# EAGLE design daclock-2.0 (EAGLE 8.0.1)
PROJECT_AUTHOR: tinkerman.cat <xose.perez@gmail.com>; PROJECT_LICENSE: CC-BY-SA-NC 3.0; PROJECT_NAME: DACLOCK WIFI; PROJECT_VERSION: 2.0.20160612
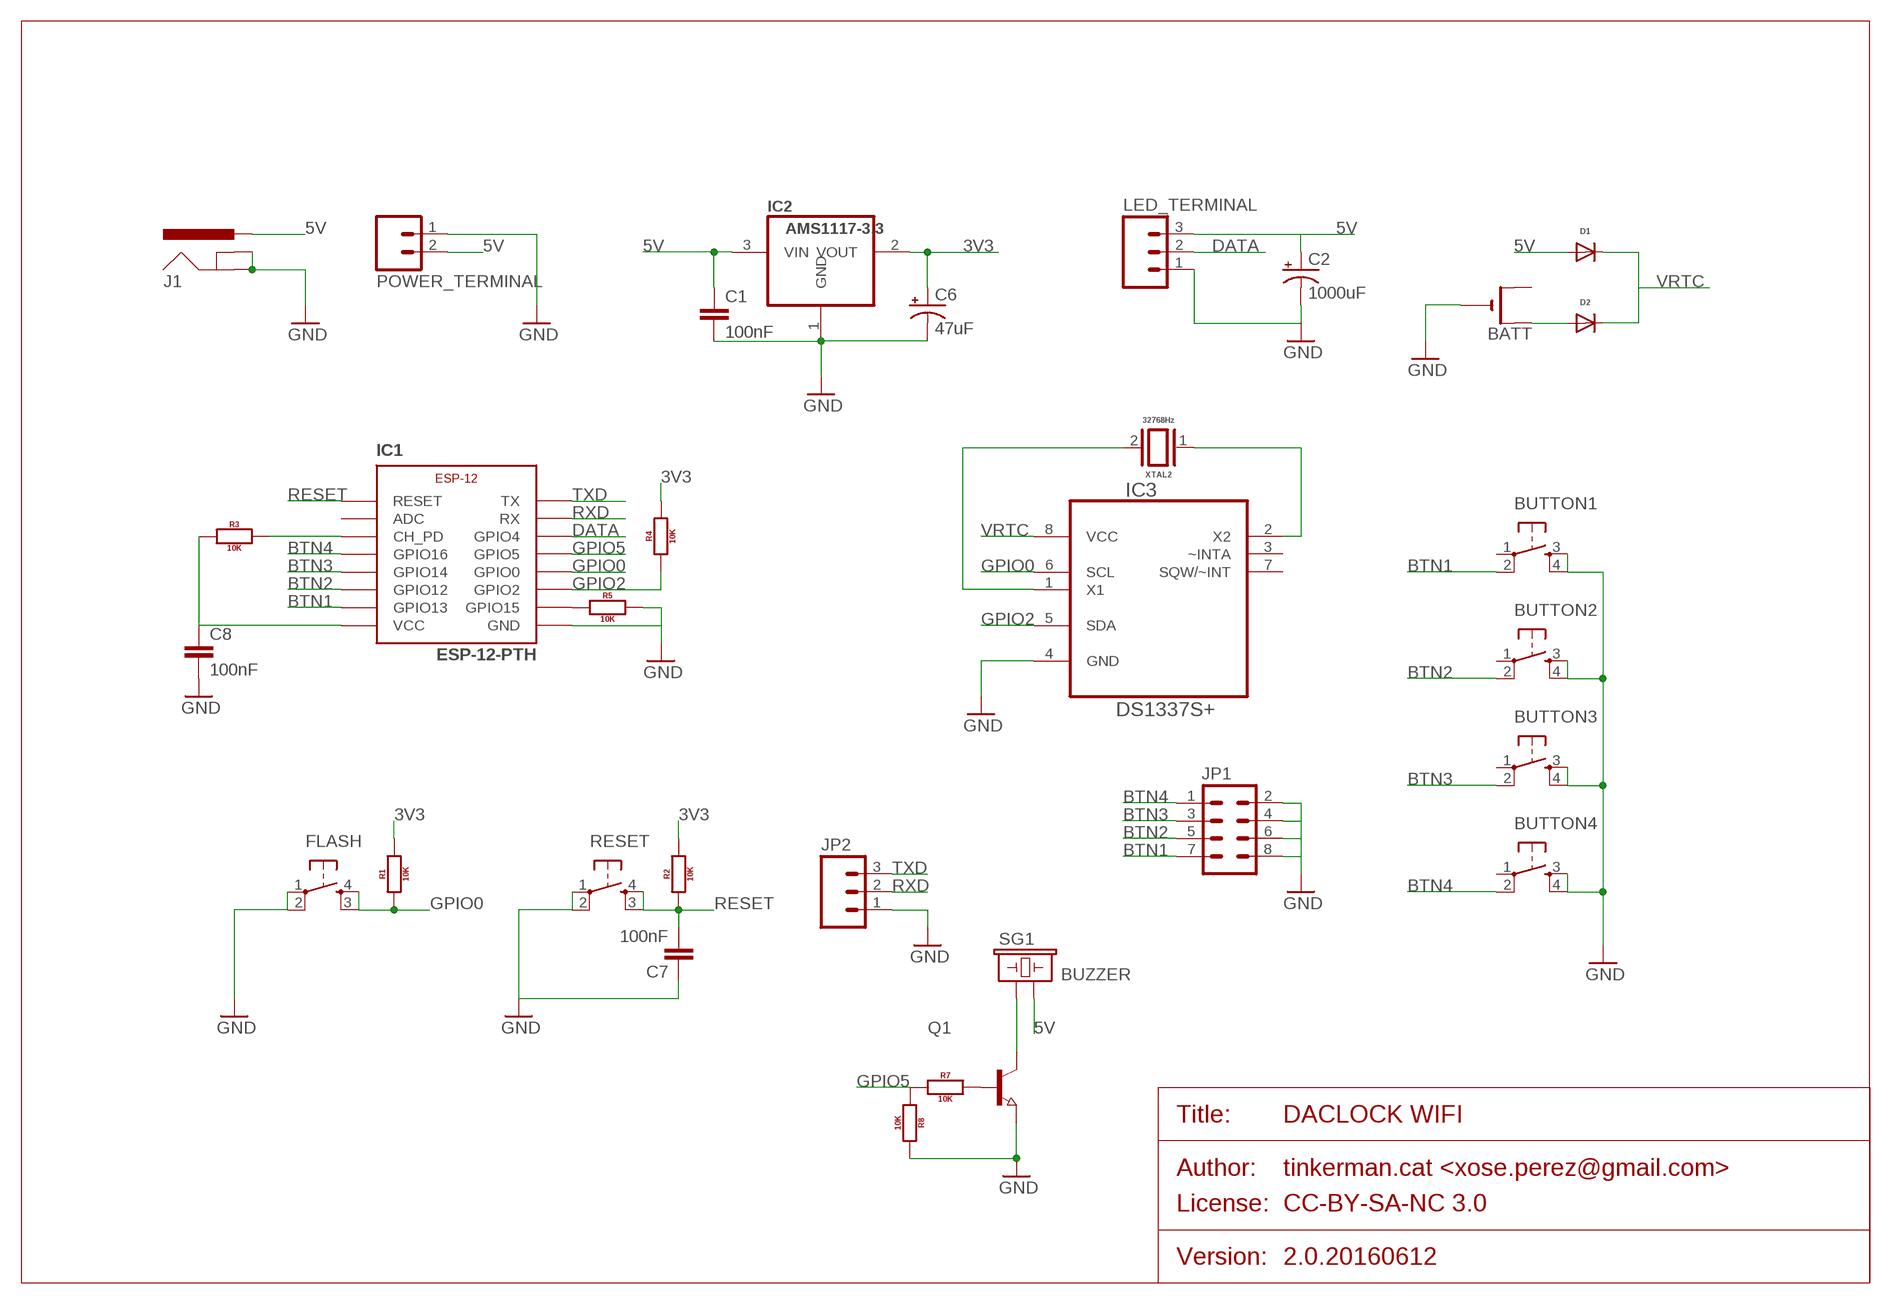
[diagram p0: schematic, sheet 1]

## Parts
BATT  CR2032SMT  [CR2032-SMD]
BUTTON1  BTN1  TACTILE_BUTTON_PTH  [TACTILE-BUTTON]
BUTTON2  BTN2  TACTILE_BUTTON_PTH  [TACTILE-BUTTON]
BUTTON3  BTN3  TACTILE_BUTTON_PTH  [TACTILE-BUTTON]
BUTTON4  BTN4  TACTILE_BUTTON_PTH  [TACTILE-BUTTON]
C1  100nF  C-EU0805  [0805]
C2  1000uF  CAP_POLG  [PANASONIC_G]
C6  47uF  CAP_POLC  [PANASONIC_C]
C7  100nF  C-EU0805  [0805]
C8  100nF  C-EU0805  [0805]
D1  DIODE-SMD  [0805_DIODE]
D2  DIODE-SMD  [0805_DIODE]
FLASH  TACTILE_BUTTON_SMD  [TACTILE-BUTTON-SMD]
IC1  ESP-12-PTH  [ESP-12-PTH]
IC2  AMS1117-3.3  REG1117  [SOT223]
IC3  DS1337S+  [SOIC127P600X175-8N]
J1  POWER_JACKPTH  [POWER_JACK_PTH]
JP1  M04X2  [2X4]
JP2  M03PTH  [1X03]
LED_TERMINAL  M03200MIL  [SCREWTERMINAL-200MIL-3]
POWER_TERMINAL  M02200MIL  [SCREWTERMINAL-200MIL-2]
Q1  NPN-TRANSISTOR_SOT23  [SOT23]
R1  10K  RESISTOR0805  [0805]
R2  10K  RESISTOR0805  [0805]
R3  10K  RESISTOR0805  [0805]
R4  10K  RESISTOR0805  [0805]
R5  10K  RESISTOR0805  [0805]
R7  10K  RESISTOR0805  [0805]
R8  10K  RESISTOR0805  [0805]
RESET  TACTILE_BUTTON_SMD  [TACTILE-BUTTON-SMD]
SG1  BUZZER  BUZZERPTH  [BUZZER-12MM]
XTAL2  32768Hz  CRYSTAL_TC38H  [TC38H]

## Nets
3V3: C6.+ C8.1 IC1.VCC IC2.2(VOUT) R1.2 R2.2 R3.1 R4.2
5V: C1.1 C2.+ D1.A IC2.3(VIN) J1.PWR LED_TERMINAL.3 POWER_TERMINAL.2 SG1.-
BTN1: BUTTON1.2(SWB1) IC1.GPIO13 JP1.7
BTN2: BUTTON2.2(SWB1) IC1.GPIO12 JP1.5
BTN3: BUTTON3.2(SWB1) IC1.GPIO14 JP1.3
BTN4: BUTTON4.2(SWB1) IC1.GPIO16 JP1.1
DATA: IC1.GPIO4 LED_TERMINAL.2
GND: BATT.- BUTTON1.3(SWA2) BUTTON1.4(SWB2) BUTTON2.3(SWA2) BUTTON2.4(SWB2) BUTTON3.3(SWA2) BUTTON3.4(SWB2) BUTTON4.3(SWA2) BUTTON4.4(SWB2) C1.2 C2.- C6.- C7.1 C8.2 FLASH.1(SWA1) FLASH.2(SWB1) IC1.GND IC2.1(GND) IC3.4(GND) J1.GND J1.GNDBREAK JP1.2 JP1.4 JP1.6 JP1.8 JP2.1 LED_TERMINAL.1 POWER_TERMINAL.1 Q1.2(E) R5.2 R8.2 RESET.1(SWA1) RESET.2(SWB1)
GPIO0: FLASH.3(SWB2) FLASH.4(SWA2) IC1.GPIO0 IC3.6(SCL) R1.1
GPIO2: IC1.GPIO2 IC3.5(SDA) R4.1
GPIO5: IC1.GPIO5 R7.1 R8.1
N$1: Q1.1(B) R7.2
N$2: IC3.1(X1) XTAL2.2
N$3: IC3.2(X2) XTAL2.1
N$4: BATT.+$1(+) D2.A
N$6: IC1.CH_PD R3.2
N$8: IC1.GPIO15 R5.1
N$10: Q1.3(C) SG1.+
RESET: C7.2 IC1.RESET R2.1 RESET.3(SWB2) RESET.4(SWA2)
RXD: IC1.RX JP2.2
TXD: IC1.TX JP2.3
VRTC: D1.C D2.C IC3.8(VCC)
Unconnected: BATT.+$2(+1) BUTTON1.1(SWA1) BUTTON2.1(SWA1) BUTTON3.1(SWA1) BUTTON4.1(SWA1) IC1.ADC IC3.3(~INTA) IC3.7(SQW/~INT)

## Library data of the parts
BATT = xose:CR2032
BUTTON1-BUTTON4 FLASH RESET = xose:TACTILE_BUTTON: Tactile Button SparkFun Electronics' Tactile Button COM-10302
C1 C7 C8 = xose:C-EU: CAPACITOR, European symbol
C2 C6 = xose:CAP_POL: Capacitor Polarized These are standard SMD and PTH capacitors. Normally 10uF, 47uF, and 100uF in electrolytic and tantalum varieties. Always verify the external diameter of the through hole cap, it varies with capacity, voltage, and manufacturer. The EIA devices should be standard.
D1 D2 = xose:DIODE
IC1 = xose:ESP-12
IC2 = xose:REG1117: 800mA and 1A Low Dropout (LDO) Positive Regulator 1.8V, 2.5V, 2.85V, 3.3V, 5V, and Adj; MPN: REG1117; OC_FARNELL: 1097566; OC_NEWARK: 14P6981
IC3 = xose:DS1337S+: 64 x 8, Serial, I2C Real-Time Clock; MPN: DS1337S+; OC_FARNELL: 1379748; OC_NEWARK: 08J6237; PACKAGE: SOIC-8; SUPPLIER: Maxim
J1 = xose:POWER_JACK: Power Jack This is the standard 5.5mm barrel jack for power. The PTH is the most common, proven, reliable, footprint. The Slot footprint only works if the mill layer is transmitted to the PCB fab house so be warned. Mating wall wart : TOL-00298 (and others); PROD_ID: CONN-08197
JP1 = xose:M04X2: .1" header, two rows of four.
JP2 LED_TERMINAL = xose:M03: Header 3 Standard 3-pin 0.1" header. Use with straight break away headers (SKU : PRT-00116), right angle break away headers (PRT-00553), swiss pins (PRT-00743), machine pins (PRT-00117), and female headers (PRT-00115). Molex polarized connector foot print use with SKU : PRT-08232 with associated crimp pins and housings.
POWER_TERMINAL = xose:M02: Standard 2-pin 0.1" header. Use with - straight break away headers ( PRT-00116) - right angle break away headers (PRT-00553) - swiss pins (PRT-00743) - machine pins (PRT-00117) - female headers (PRT-00115) Molex polarized connector foot print use with: PRT-08233 with associated crimp pins and housings. 2.54_SCREWTERM for use with PRT-10571. 3.5mm Screw Terminal footprints for PRT-08084 5mm Screw Terminal footprints for use with PRT-08432
Q1 = xose:NPN-TRANSISTOR_: NPN TRANSISTOR
R1-R5 R7 R8 = xose:RESISTOR: Generic EU resistor symbol
SG1 = SparkFun-Electromechanical:BUZZER: Buzzer 12mm Spark Fun Electronics SKU : Comp-Buzzer
XTAL2 = xose:CRYSTAL_TC38H

## Board
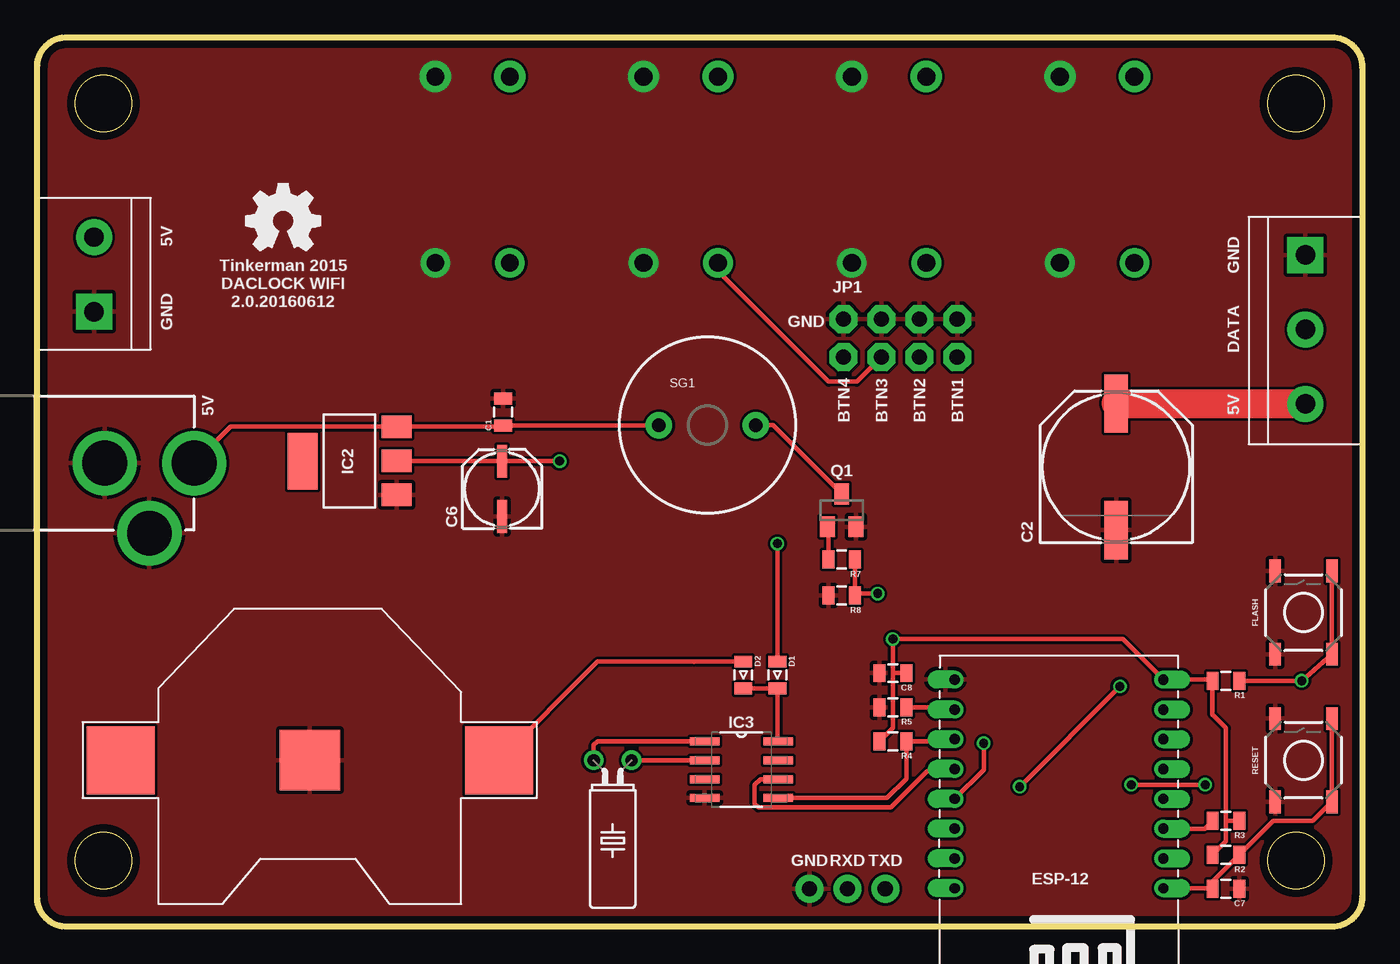
[diagram p1: board, top side]
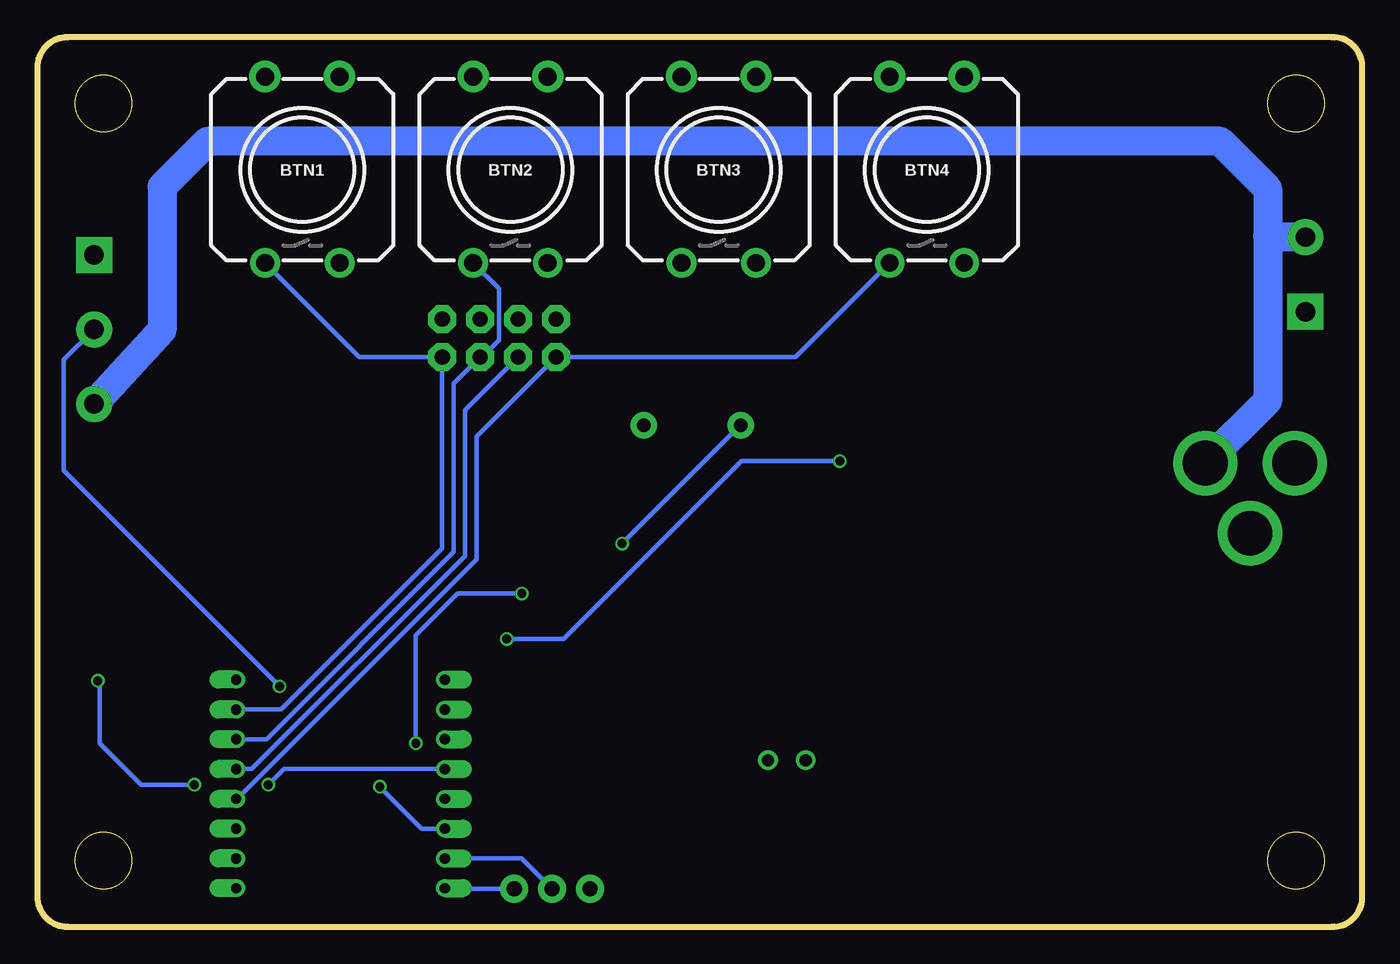
[diagram p2: board, bottom side, seen from below]

Size 88.9 x 59.69 mm. Coordinates in mm from the lower left corner, seen from the top.
Outline: 86.87,0 2.03,0 arc-90 0,1.91 0,57.78 arc-90 2.03,59.69 86.87,59.69 arc-90 88.9,57.66 88.9,2.03 arc-90 86.87,0
Outline: circle at 4.45,55.24 radius 1.91
Outline: circle at 4.45,4.45 radius 1.91
Outline: circle at 84.45,55.24 radius 1.91
Outline: circle at 84.45,4.45 radius 1.91
Copper layers (1*16): Top 0.035mm / dielectric 1.5mm / Bottom 0.035mm
Design rules "smart-prototyping": minimum track width 7mil, minimum drill 12mil, track to track 7mil, track to pad 7mil, pad to pad 7mil, via to via 7mil, smd to smd 0mil, copper to edge 20mil, drill to drill 10mil, minimum pad ring 10mil, minimum via ring 6mil, stop-mask expansion 2mil, vias tented up to drill 25mil, thermal gap 10mil

### Footprints (pad centres in the part's own frame; a part is rotated, then mirrored left to right if it is on the bottom)
CR2032-SMD = smd 4.572 x 4.572: +$1 -12.7,0; +$2 12.7,0 | smd 4.064 x 4.064: - 0,0
TACTILE-BUTTON = drill 1.2 pad 2.1: 1 -2.5,6.25; 3 2.5,6.25 | drill 1.2 pad 2: 2 -2.5,-6.25; 4 2.5,-6.25
0805 = smd 0.8 x 1.2: 1 -0.9,0; 2 0.9,0
PANASONIC_G = smd 3.9 x 1.6: + 4.25,0; - -4.25,0
PANASONIC_C = smd 2.2 x 0.65: + 1.9,-0.2; - -1.8,-0.2
0805_DIODE = smd 0.8 x 1.2: A -0.9,0; C 0.9,0
TACTILE-BUTTON-SMD = smd 1.524 x 0.762: 1 -2.794,1.905; 2 2.794,1.905; 3 -2.794,-1.905; 4 2.794,-1.905
ESP-12-PTH = drill 0.7 offset: ADC -6.465,5.07; CH_PD -6.465,3.07; GND 7.535,-6.93; GPIO0 7.535,-0.93; GPIO2 7.535,-2.93; GPIO4 7.535,3.07; GPIO5 7.535,1.07; GPIO12 -6.465,-2.93; GPIO13 -6.465,-4.93; GPIO14 -6.465,-0.93; GPIO15 7.535,-4.93; GPIO16 -6.465,1.07; RESET -6.465,7.07; RX 7.535,5.07; TX 7.535,7.07; VCC -6.465,-6.93
SOT223 = smd 1.499 x 2.007: 1 -2.261,-3.15; 2 0.025,-3.15; 3 2.311,-3.15 | smd 3.81 x 2.007: 4 0,3.15
SOIC127P600X175-8N = smd 1.981 x 0.533: 1 -2.464,1.905; 2 -2.464,0.635; 3 -2.464,-0.635; 4 -2.464,-1.905; 5 2.464,-1.905; 6 2.464,-0.635; 7 2.464,0.635; 8 2.464,1.905
POWER_JACK_PTH = drill 2.997 pad 4.318: GND 0,7.7; GNDBREAK 4.7,10.7; PWR 0,13.7
2X4 = drill 1.016 pad 1.88 octagon: 1 -3.81,-1.27; 2 -3.81,1.27; 3 -1.27,-1.27; 4 -1.27,1.27; 5 1.27,-1.27; 6 1.27,1.27; 7 3.81,-1.27; 8 3.81,1.27
1X03 = drill 1.016 pad 1.88: 1 0,0; 2 2.54,0; 3 5.08,0
SCREWTERMINAL-200MIL-3 = drill 1.3 pad 2.413 square: 1 0,0 | drill 1.3 pad 2.413: 2 5,0; 3 10,0
SCREWTERMINAL-200MIL-2 = drill 1.3 pad 2.413 square: 1 0,0 | drill 1.3 pad 2.413: 2 5,0
SOT23 = smd 1 x 1.4: 1 -0.95,-1.1; 2 0.95,-1.1; 3 0,1.1
BUZZER-12MM = drill 0.9 pad 1.778: + 3.25,0; - -3.25,0
TC38H = drill 0.813: 1 -1.27,0; 2 1.27,0

### Placement (x,y rotation side)
BATT  18.29,11.18 180 top
BUTTON1  71.12,50.8 0 bottom
BUTTON2  57.15,50.8 0 bottom
BUTTON3  43.18,50.8 0 bottom
BUTTON4  29.21,50.8 0 bottom
C1  31.24,34.54 90 top
C2  72.39,30.86 90 top
C6  30.99,29.34 90 top
C7  79.76,2.54 180 top
C8  57.4,17.02 180 top
D1  49.66,16.89 270 top
D2  47.37,16.89 270 top
FLASH  84.96,21.08 90 top
IC1  69.09,9.65 180 top
IC2  20.95,31.24 90 top
IC3  47.24,10.54 0 top
J1  -3.17,31.11 270 top
JP1  57.91,39.5 0 top
JP2  51.82,2.54 0 top
LED_TERMINAL  85.09,45.09 270 top
POWER_TERMINAL  3.81,41.27 90 top
Q1  53.98,27.94 0 top
R1  79.76,16.51 180 top
R2  79.76,4.83 180 top
R3  79.76,7.11 180 top
R4  57.4,12.45 180 top
R5  57.4,14.73 180 top
R7  53.98,24.64 180 top
R8  53.98,22.23 180 top
RESET  84.96,11.18 90 top
SG1  44.96,33.66 0 top
XTAL2  38.61,11.18 180 top

### Tracks (layer width: path | path; a pad name or v marks a point on that pad's centre or on a via)
3V3  (via drill 0.6)
  Top 0.305: IC2.2 31.16,31.27 C6.+ v35.05,31.24 | 79.76,7.11 79.76,5.73 R2.2 | 79.76,7.11 79.76,13.34 78.87,14.22 78.86,14.22 R1.2 78.78,16.58 IC1.VCC 72.83,19.3 v57.4,19.3 57.4,17.02 | R3.1 79.76,7.11 | R4.2 57.4,13.35 57.4,17.02 | C8.1 57.4,17.02
  Bottom 0.305: v57.4,19.3 53.59,19.3 41.66,31.24 v35.05,31.24
5V  (via drill 0.6)
  Top 0.305: J1.PWR 12.96,33.55 IC2.3 31.15,33.55 C1.1 41.7,33.64 SG1.- | D1.A v49.66,25.71
  Top 1.93: C2.+ 85.06,35.11 LED_TERMINAL.3
  Bottom 0.305: v49.66,25.71 SG1.-
  Bottom 1.93: LED_TERMINAL.3 80.52,40.04 80.52,49.66 77.47,52.7 9.53,52.7 6.35,49.53 6.35,46.35 | 6.35,46.35 6.35,35.29 J1.PWR | POWER_TERMINAL.2 6.27,46.27 6.35,46.35
BTN1
  Bottom 0.305: IC1.GPIO13 72.54,14.58 61.72,25.4 JP1.7 67.3,38.23 BUTTON1.2
BTN2
  Bottom 0.305: IC1.GPIO12 73.52,12.58 60.96,25.15 60.96,36.45 JP1.5 59.05,38.23 57.91,39.37 57.91,42.81 BUTTON2.2
BTN3
  Top 0.305: JP1.3 54.99,36.58 53.09,36.58 45.68,43.98 BUTTON3.2
  Bottom 0.305: IC1.GPIO14 74.51,10.58 60.2,24.89 60.2,34.67 JP1.3
BTN4
  Bottom 0.305: IC1.GPIO16 75.49,8.58 59.44,24.64 59.44,32.89 JP1.1 38.03,38.23 BUTTON4.2
DATA  (via drill 0.6)
  Top 0.305: v65.91,9.4 v72.64,16.13
  Bottom 0.305: IC1.GPIO4 63.1,6.58 v65.91,9.4 | v72.64,16.13 87.12,30.61 87.12,38.05 LED_TERMINAL.2
GND
  pour Top: 0,59.69 88.9,59.69 88.9,0 0,0
GPIO0  (via drill 0.6)
  Top 0.305: FLASH.4 FLASH.3 v84.84,16.51 R1.1 80.66,16.52 | v78.36,9.53 v73.41,9.53 | IC1.GPIO0 61.38,10.41 59.69,10.41 57.28,8 48.39,8 48.13,8.26 48.13,9.53 48.51,9.91 IC3.6
  Bottom 0.305: v78.36,9.53 81.92,9.53 84.71,12.32 84.71,16.38 v84.84,16.51 | v73.41,9.53 72.35,10.58 IC1.GPIO0
GPIO2
  Top 0.305: IC3.5 57.02,8.64 58.3,9.92 R4.1 61.55,12.45 IC1.GPIO2
GPIO5  (via drill 0.6)
  Top 0.305: IC1.GPIO5 63.5,10.53 v63.5,12.32 | v56.39,22.35 54.88,22.35 | R7.1 54.88,22.35 | 54.88,22.35 R8.1
  Bottom 0.305: v63.5,12.32 63.5,19.56 60.71,22.35 v56.39,22.35
N$1
  Top 0.305: Q1.1 53.08,26.84 R7.2
N$2
  Top 0.305: XTAL2.2 37.34,12.19 37.59,12.45 IC3.1
N$3
  Top 0.305: XTAL2.1 IC3.2
N$4
  Top 0.305: 44.06,17.78 D2.A 37.6,17.79 BATT.+$1
N$6
  Top 0.305: IC1.CH_PD 78.33,6.58 R3.2
N$8
  Top 0.305: R5.1 61.55,14.73 IC1.GPIO15
N$10
  Top 0.305: SG1.+ 49.36,33.66 Q1.3
RESET
  Top 0.305: IC1.RESET 78.81,2.58 C7.2 78.86,3.03 R2.1 82.94,7.11 85.6,7.11 RESET.3 RESET.4
RXD
  Bottom 0.305: IC1.RX 56.4,4.58 JP2.2
TXD
  Bottom 0.305: IC1.TX 61.51,2.54 JP2.3
VRTC
  Top 0.305: D2.C D1.C 49.66,12.5 IC3.8

### Text on the board
tPlace: 5V | GND | Tinkerman 2015 / DACLOCK WIFI / 2.0.20160612 | GND | GND | DATA | BTN4 | BTN3 | BTN2 | BTN1 | 5V | 5V | GND | RXD | TXD